# Altium schematic sheet COMMUNICATE.SchDoc
size 420 x 297 mm; SheetNumber: 3; SheetTotal: 4
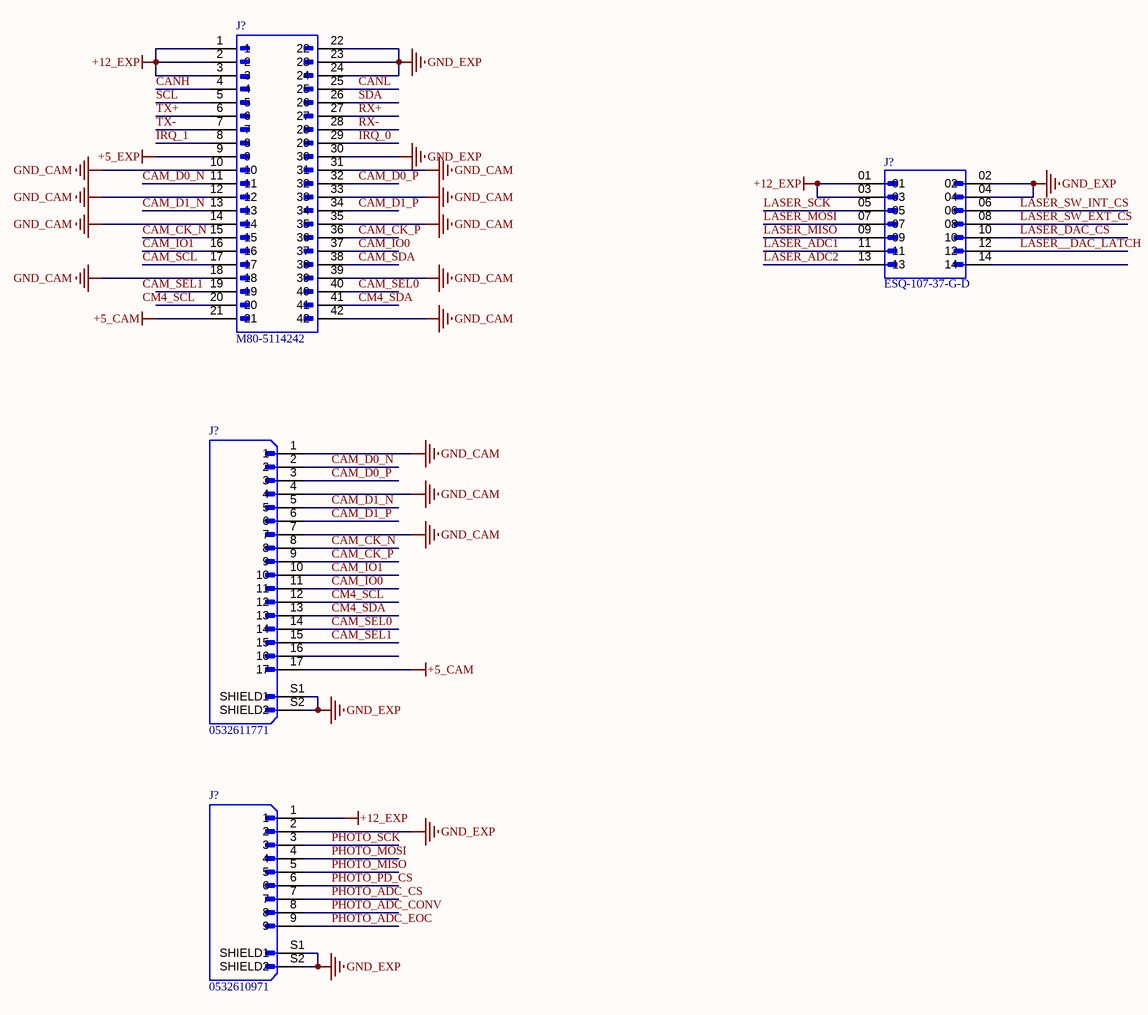
[diagram p0: COMMUNICATE.SchDoc]

## Parts
(Parts that share a designator on the sheet are numbered #1, #2 ... from top to bottom, then left to right.)
J?#1  M80-5114242  [M80-5114242]
J?#2  ESQ-107-37-G-D  [ESQ-107-37-G-D]
J?#3  0532611771
J?#4  0532610971  [0532610971]

## Nets
+5_CAM: J?#1.21 J?#3.17
+5_EXP: J?#1.9
+12_EXP: J?#1.1 J?#1.2 J?#1.3 J?#2.01 J?#2.03 J?#4.1
GND_CAM: J?#1.10 J?#1.12 J?#1.14 J?#1.18 J?#1.31 J?#1.33 J?#1.35 J?#1.39 J?#1.42 J?#3.1 J?#3.4 J?#3.7
GND_EXP: J?#1.22 J?#1.23 J?#1.24 J?#1.30 J?#2.02 J?#2.04 J?#3.S1(SHIELD1) J?#3.S2(SHIELD2) J?#4.2 J?#4.S1(SHIELD1) J?#4.S2(SHIELD2)
CAM_CK_N: J?#1.15 J?#3.8
CAM_CK_P: J?#1.36 J?#3.9
CAM_D0_N: J?#1.11 J?#3.2
CAM_D0_P: J?#1.32 J?#3.3
CAM_D1_N: J?#1.13 J?#3.5
CAM_D1_P: J?#1.34 J?#3.6
CAM_IO0: J?#1.37 J?#3.11
CAM_IO1: J?#1.16 J?#3.10
CAM_SCL: J?#1.17
CAM_SDA: J?#1.38
CAM_SEL0: J?#1.40 J?#3.14
CAM_SEL1: J?#3.15
CANH: J?#1.4
CANL: J?#1.25
CM4_SCL: J?#3.12
CM4_SDA: J?#1.41 J?#3.13
IRQ_0: J?#1.29
IRQ_1: J?#1.8
LASER__DAC_LATCH: J?#2.12
LASER_ADC1: J?#2.11
LASER_ADC2: J?#2.13
LASER_DAC_CS: J?#2.10
LASER_MISO: J?#2.09
LASER_MOSI: J?#2.07
LASER_SCK: J?#2.05
LASER_SW_EXT_CS: J?#2.08
LASER_SW_INT_CS: J?#2.06
PHOTO_ADC_CONV: J?#4.8
PHOTO_ADC_CS: J?#4.7
PHOTO_ADC_EOC: J?#4.9
PHOTO_MISO: J?#4.5
PHOTO_MOSI: J?#4.4
PHOTO_PD_CS: J?#4.6
PHOTO_SCK: J?#4.3
RX+: J?#1.27
RX-: J?#1.28
SCL: J?#1.5
SDA: J?#1.26
TX+: J?#1.6
TX-: J?#1.7

Not connected (* = marked no-connect by the designer): J?#1 19 20; J?#2 14; J?#3 16

## Notes on the sheet
- Labels drawn without touching a wire or pin: CAM_SEL1, CM4_SCL
- Project:
- PEE-PC1
- Sub-system:
- NANORACK_EXP_CONTROLLER
- Design by:
- SANG HUYNH
- BAO BUI Q.
- Sheet title:
- Sheet
- A3
- of
- Checked by:
- Approved by:
- VU PHAM
- Revision:
- Document No:
- V1.0.0
- Size:
- Date:

## Library data of the parts
J?#1 = CONN_TH_42: CONN HEADER VERT 42POS 2MM
J?#2 = CONN_TH_14: CONN SOCKET 14POS 0.1 GOLD PCB
J?#3 = CONN_SMD_17: CONN HEADER SMD R/A 17POS 1.25MM
J?#4 = CONN_SMD_09: CONN HEADER SMD R/A 9POS 1.25MM